# Altium project _K1986VK025 MiniBoard.PrjPCB
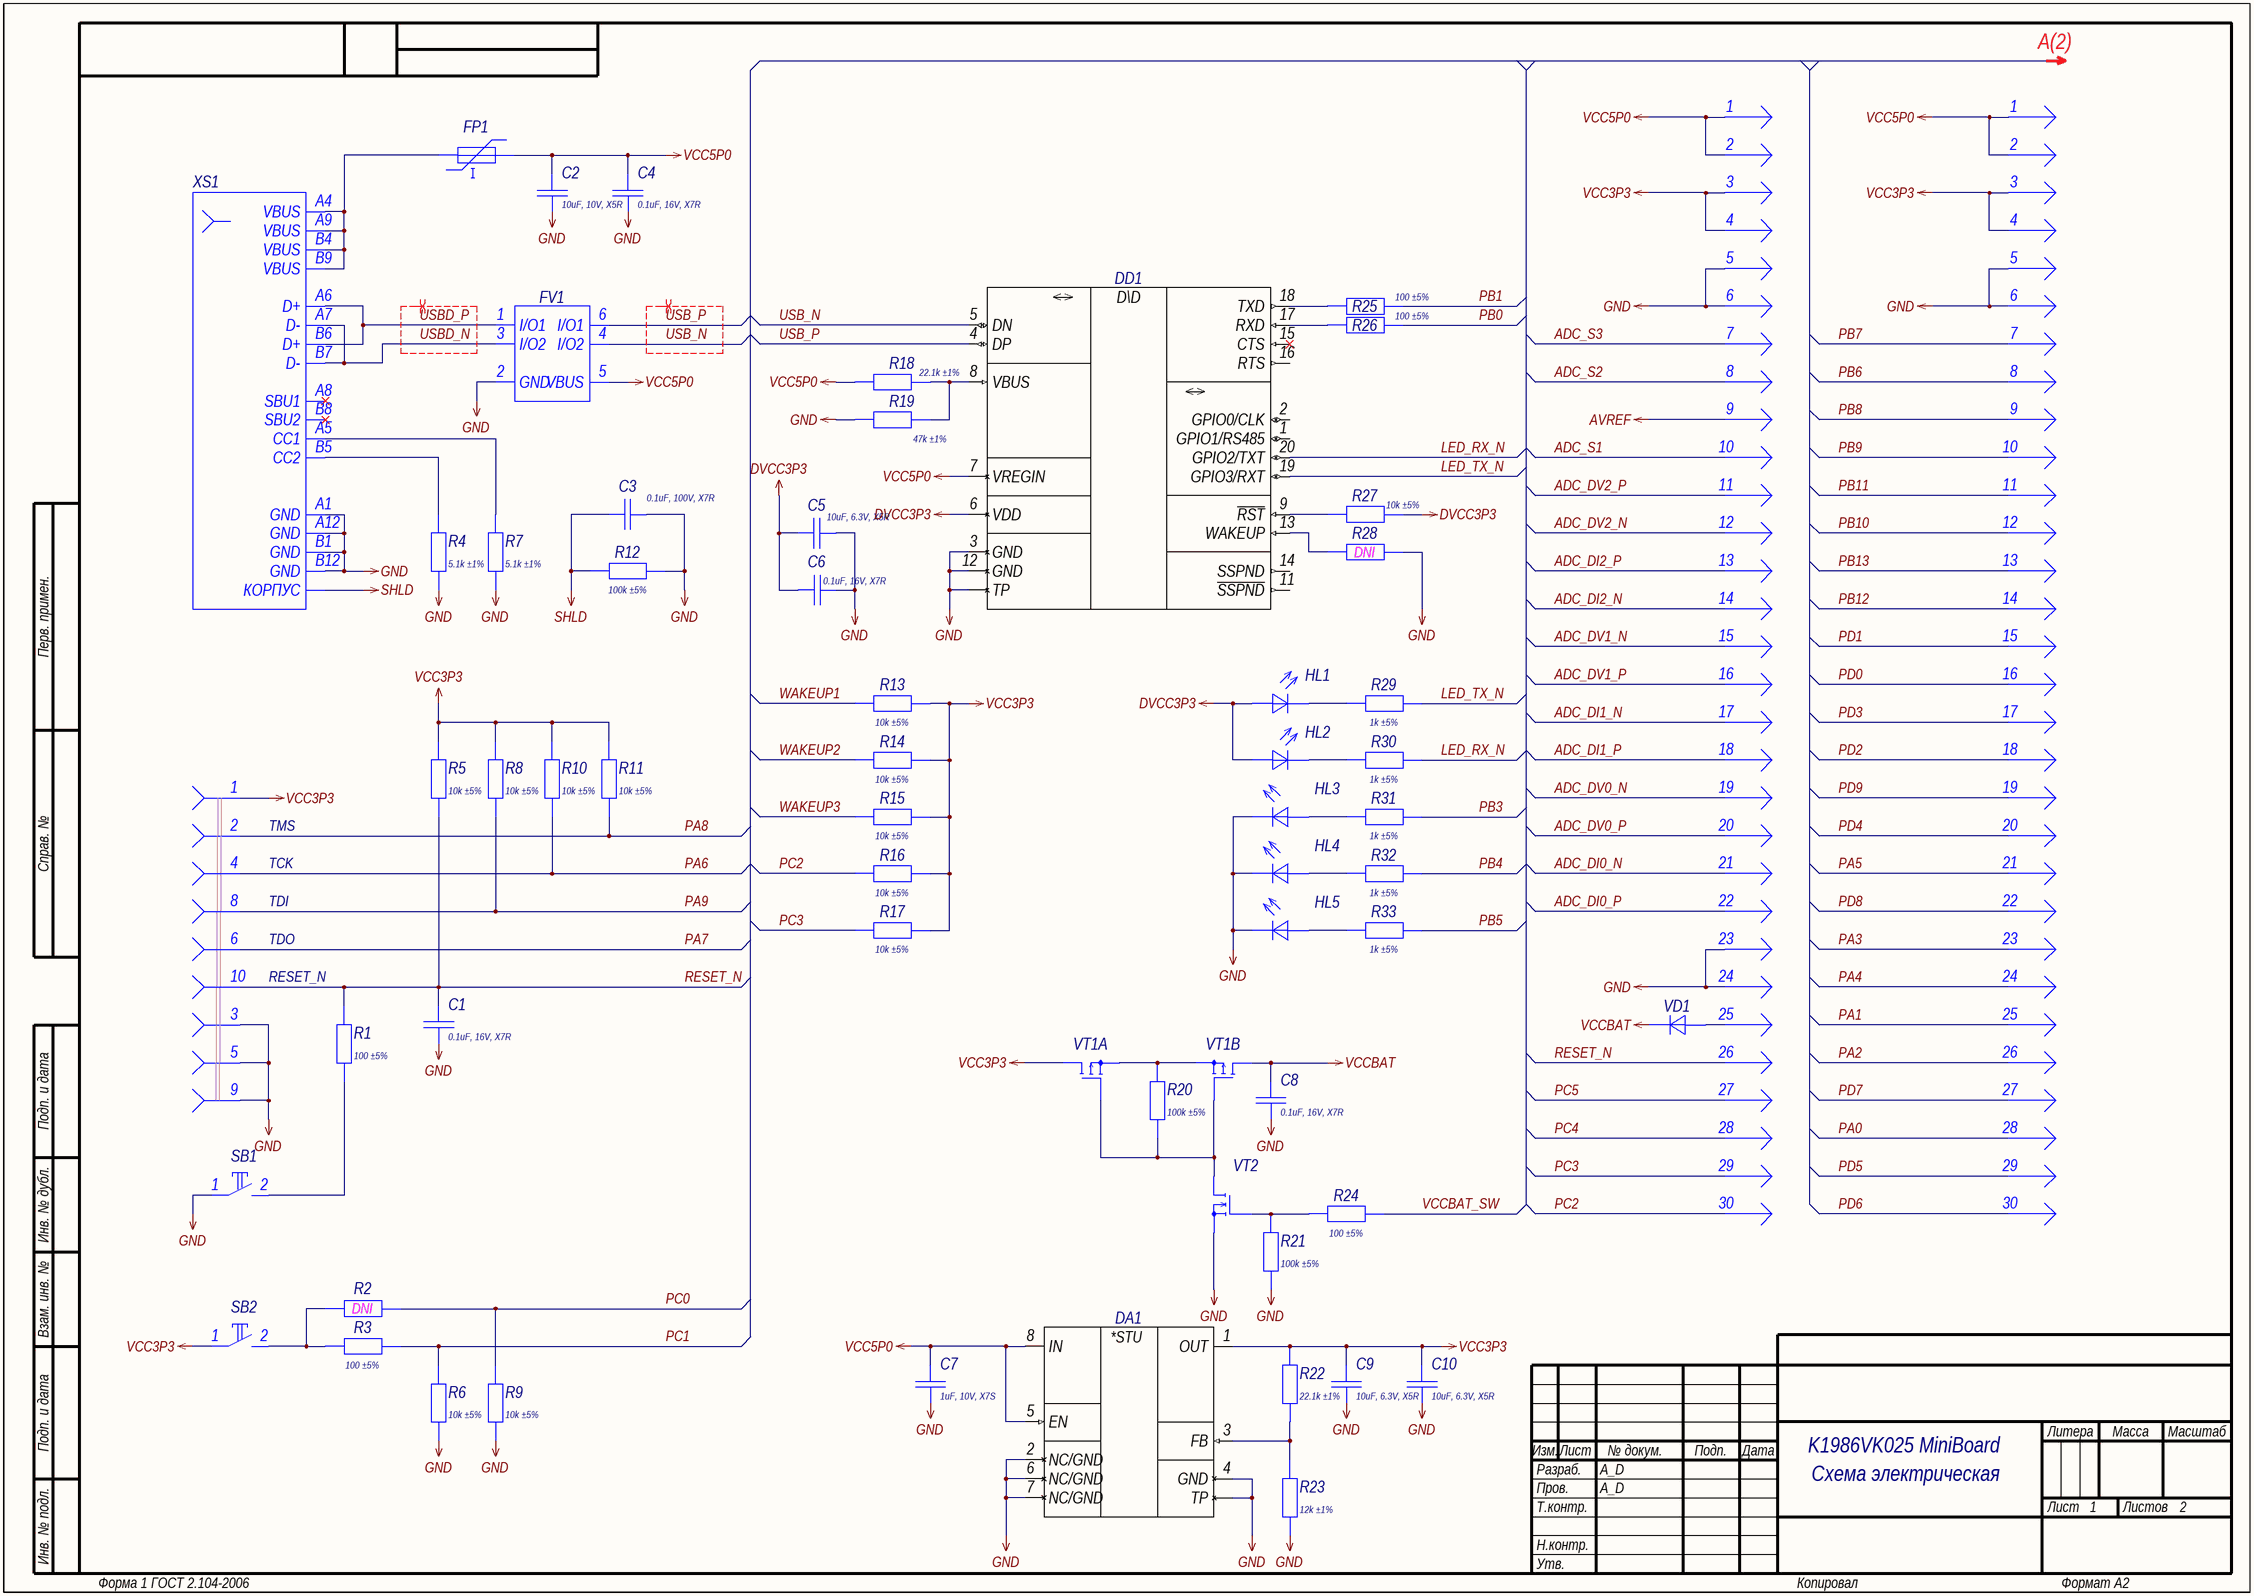
[diagram p0: 01_USB_IO.SchDoc]
GlobalOrganizationName: A_D Electronics; GlobalProjectName: K1986VK025 MiniBoard; GlobalProjectNumber: A_D.000000.001; GlobalProjectRevision: 0; PCB_Week: 2109
2 sheets, 91 parts. Net scope: global (net labels, ports and power ports of the same name join across sheets).
Board file: BOARD.PcbDoc
Sheets:
  01_USB_IO.SchDoc
  02_MCU_ANALOG.SchDoc

## Sheet 01_USB_IO.SchDoc: =GlobalProjectName
size 594 x 420 mm; CheckedBy: A_D; Author: A_D; Organization: A_D Electronics; DocumentNumber: A_D.000000.001 Э3; Revision: 0; SheetNumber: 1; SheetTotal: 2; PageSetup: Record=PageOptions|CenterHorizontal=True|CenterVertical=True|PrintScale=0.70|XCorrection=1.00|YCorrection=1.00|PrintKind=2|BorderSize=5000000|LeftOffset=9000|BottomOffset=10100|Orientation=2|PaperLength=11176|PaperWidth=8636|Scale=100|PaperSource=259|PrintQuality=-3|MediaType=1|DitherType=10|PrintScaleMode=1|PaperKind=A3|PaperIndex=8; FirstApplication: A_D.000000.001; DocumentName: K1986VK025 MiniBoard

### Parts
C1  Schematic Value: 0.1uF, 16V, X7R  [C0402_100X050H050_H]  (hidden comment: Capacitor)
C2  Schematic Value: 10uF, 10V, X5R  [C0603_160X080H080_H]  (hidden comment: Capacitor)
C3  Schematic Value: 0.1uF, 100V, X7R  [C0603_160X080H080_H]  (hidden comment: Capacitor)
C4  Schematic Value: 0.1uF, 16V, X7R  [C0402_100X050H050_H]  (hidden comment: Capacitor)
C5  Schematic Value: 10uF, 6.3V, X5R  [C0402_100X050H050_H]  (hidden comment: Capacitor)
C6  Schematic Value: 0.1uF, 16V, X7R  [C0402_100X050H050_H]  (hidden comment: Capacitor)
C7  Schematic Value: 1uF, 10V, X7S  [C0402_100X050H050_H]  (hidden comment: Capacitor)
C8  Schematic Value: 0.1uF, 16V, X7R  [C0402_100X050H050_H]  (hidden comment: Capacitor)
C9  Schematic Value: 10uF, 6.3V, X5R  [C0402_100X050H050_H]  (hidden comment: Capacitor)
C10  Schematic Value: 10uF, 6.3V, X5R  [C0402_100X050H050_H]  (hidden comment: Capacitor)
DA1  TPS73501DRB  [VSON-8_065P300X300X100_N]  (value not drawn)
DD1  CP2102N-xxx-GQFN20  [QFN-20_050P300X300X080_N]  (value not drawn)
FP1  Fuse_PTC  [F0603_160X080H075_H]  (value not drawn)
FV1  USBLC6-2x6  [SOT-666_050P160X120X060_N]  (value not drawn)
HL1  TX  [LD0402]  (value not drawn)
HL2  RX  [LD0402]  (value not drawn)
HL3  PB3  [LD0402]  (value not drawn)
HL4  PB4  [LD0402]  (value not drawn)
HL5  PB5  [LD0402]  (value not drawn)
R1  Schematic Value: 100 ±5%  [R0402_100X050H035_H]  (hidden comment: Resistor)
R2  Resistor  [R0402_100X050H035_H]  (value not drawn)  (no BOM)
R3  Schematic Value: 100 ±5%  [R0402_100X050H035_H]  (hidden comment: Resistor)
R4  Schematic Value: 5.1k ±1%  [R0402_100X050H035_H]  (hidden comment: Resistor)
R5  Schematic Value: 10k ±5%  [R0402_100X050H035_H]  (hidden comment: Resistor)
R6  Schematic Value: 10k ±5%  [R0402_100X050H035_H]  (hidden comment: Resistor)
R7  Schematic Value: 5.1k ±1%  [R0402_100X050H035_H]  (hidden comment: Resistor)
R8  Schematic Value: 10k ±5%  [R0402_100X050H035_H]  (hidden comment: Resistor)
R9  Schematic Value: 10k ±5%  [R0402_100X050H035_H]  (hidden comment: Resistor)
R10  Schematic Value: 10k ±5%  [R0402_100X050H035_H]  (hidden comment: Resistor)
R11  Schematic Value: 10k ±5%  [R0402_100X050H035_H]  (hidden comment: Resistor)
R12  Schematic Value: 100k ±5%  [R0402_100X050H035_H]  (hidden comment: Resistor)
R13  Schematic Value: 10k ±5%  [R0402_100X050H035_H]  (hidden comment: Resistor)
R14  Schematic Value: 10k ±5%  [R0402_100X050H035_H]  (hidden comment: Resistor)
R15  Schematic Value: 10k ±5%  [R0402_100X050H035_H]  (hidden comment: Resistor)
R16  Schematic Value: 10k ±5%  [R0402_100X050H035_H]  (hidden comment: Resistor)
R17  Schematic Value: 10k ±5%  [R0402_100X050H035_H]  (hidden comment: Resistor)
R18  Schematic Value: 22.1k ±1%  [R0402_100X050H035_H]  (hidden comment: Resistor)
R19  Schematic Value: 47k ±1%  [R0402_100X050H035_H]  (hidden comment: Resistor)
R20  Schematic Value: 100k ±5%  [R0402_100X050H035_H]  (hidden comment: Resistor)
R21  Schematic Value: 100k ±5%  [R0402_100X050H035_H]  (hidden comment: Resistor)
R22  Schematic Value: 22.1k ±1%  [R0402_100X050H035_H]  (hidden comment: Resistor)
R23  Schematic Value: 12k ±1%  [R0402_100X050H035_H]  (hidden comment: Resistor)
R24  Schematic Value: 100 ±5%  [R0402_100X050H035_H]  (hidden comment: Resistor)
R25  Schematic Value: 100 ±5%  [R0402_100X050H035_H]  (hidden comment: Resistor)
R26  Schematic Value: 100 ±5%  [R0402_100X050H035_H]  (hidden comment: Resistor)
R27  Schematic Value: 10k ±5%  [R0402_100X050H035_H]  (hidden comment: Resistor)
R28  Resistor  [R0402_100X050H035_H]  (value not drawn)  (no BOM)
R29  Schematic Value: 1k ±5%  [R0402_100X050H035_H]  (hidden comment: Resistor)
R30  Schematic Value: 1k ±5%  [R0402_100X050H035_H]  (hidden comment: Resistor)
R31  Schematic Value: 1k ±5%  [R0402_100X050H035_H]  (hidden comment: Resistor)
R32  Schematic Value: 1k ±5%  [R0402_100X050H035_H]  (hidden comment: Resistor)
R33  Schematic Value: 1k ±5%  [R0402_100X050H035_H]  (hidden comment: Resistor)
SB1  Reset  [IT-1185AP]  (value not drawn)
SB2  Mode  [IT-1185AP]  (value not drawn)
VD1  Diode  [SOD-523]  (value not drawn)
VT1  MOSFET-PP_8p_2  [SOT-1118-2M_065P200X200X065_N]  (value not drawn)  (parts A,B of 2)
VT2  MOSFET-N_32  [SOT-883B_035P060X100X040_N]  (value not drawn)
XP1  Text  [PLD-30]  (value not drawn)  (parts A,B,C,D,E,F,G,H,I,J,K,L,M,N,O,P,Q,R,S,T,U,V,W,X,Y,Z,27,28,29,30 of 30)
XP2  Text  [PLD-30]  (value not drawn)  (parts A,B,C,D,E,F,G,H,I,J,K,L,M,N,O,P,Q,R,S,T,U,V,W,X,Y,Z,27,28,29,30 of 30)
XS1  Text  [U262-161N-4BVC11]  (value not drawn)
XS2  JTAG-FFC  [XF2M-1015-1A]  (value not drawn)  (parts A,B,C,D,E,F,H,I,J of 10)

### Nets
AVREF: XP1.9
DVCC3P3: C5.2 C6.1 DD1.6(VDD) HL1.1(А) HL2.1(А) R27.1
GND: C1.2 C2.1 C3.1 C4.1 C5.1 C6.2 C7.1 C8.2 C9.1 C10.1 DA1.2(NC/GND) DA1.4(GND) DA1.6(NC/GND) DA1.7(NC/GND) DA1.TP DD1.3(GND) DD1.12(GND) DD1.TP FV1.2(GND) HL3.2(К) HL4.2(К) HL5.2(К) R4.1 R6.1 R7.1 R9.1 R12.1 R19.2 R21.1 R23.1 R28.1 SB1.1 VT2.2(S) XP1.5 XP1.6 XP1.23 XP1.24 XP2.5 XP2.6 XS1.A1(GND) XS1.A12(GND) XS1.B1(GND) XS1.B12(GND) XS2.3 XS2.5 XS2.9
SHLD: C3.2 R12.2 XS1.SH(КОРПУС)
VCC3P3: C9.2 C10.2 DA1.1(OUT) R5.2 R8.2 R10.2 R11.2 R13.1 R14.1 R15.1 R16.1 R17.1 R22.2 SB2.1 VT1.6(D1) XP1.3 XP1.4 XP2.3 XP2.4 XS2.1
VCC5P0: C2.2 C4.2 C7.2 DA1.5(EN) DA1.8(IN) DD1.7(VREGIN) FP1.2 FV1.5(VBUS) R18.2 XP1.1 XP1.2 XP2.1 XP2.2
VCCBAT: C8.1 VD1.2(К) VT1.3(D2)
ADC_DI0_N: XP1.21
ADC_DI0_P: XP1.22
ADC_DI1_N: XP1.17
ADC_DI1_P: XP1.18
ADC_DI2_N: XP1.14
ADC_DI2_P: XP1.13
ADC_DV0_N: XP1.19
ADC_DV0_P: XP1.20
ADC_DV1_N: XP1.15
ADC_DV1_P: XP1.16
ADC_DV2_N: XP1.12
ADC_DV2_P: XP1.11
ADC_S1: XP1.10
ADC_S2: XP1.8
ADC_S3: XP1.7
LED_RX_N: DD1.20(GPIO2/TXT) R30.2
LED_TX_N: DD1.19(GPIO3/RXT) R29.2
PA0: XP2.28
PA1: XP2.25
PA2: XP2.26
PA3: XP2.23
PA4: XP2.24
PA5: XP2.21
PA6: R10.1 XS2.4
PA7: XS2.6
PA8: R11.1 XS2.2
PA9: R8.1 XS2.8
PB0: R26.1
PB1: R25.1
PB3: R31.2
PB4: R32.2
PB5: R33.2
PB6: XP2.8
PB7: XP2.7
PB8: XP2.9
PB9: XP2.10
PB10: XP2.12
PB11: XP2.11
PB12: XP2.14
PB13: XP2.13
PC0: R2.1 R9.2
PC1: R3.1 R6.2
PC2: R16.2 XP1.30
PC3: R17.2 XP1.29
PC4: XP1.28
PC5: XP1.27
PD0: XP2.16
PD1: XP2.15
PD2: XP2.18
PD3: XP2.17
PD4: XP2.20
PD5: XP2.29
PD6: XP2.30
PD7: XP2.27
PD8: XP2.22
PD9: XP2.19
RESET_N: C1.1 R1.2 R5.1 XP1.26 XS2.10
USB_N: DD1.5(DN) FV1.4(I/O2)
USB_P: DD1.4(DP) FV1.6(I/O1)
USBD_N: FV1.3(I/O2) XS1.A7(D-) XS1.B7(D-)
USBD_P: FV1.1(I/O1) XS1.A6(D+) XS1.B6(D+)
VCCBAT_SW: R24.1
WAKEUP1: R13.2
WAKEUP2: R14.2
WAKEUP3: R15.2
NetDA1_3: DA1.3(FB) R22.1 R23.2
NetDD1_8: DD1.8(VBUS) R18.1 R19.1
NetDD1_9: DD1.9(~{RST}) R27.2
NetDD1_13: DD1.13(WAKEUP) R28.2
NetDD1_17: DD1.17(RXD) R26.2
NetDD1_18: DD1.18(TXD) R25.2
NetFP1_1: FP1.1 XS1.A4(VBUS) XS1.A9(VBUS) XS1.B4(VBUS) XS1.B9(VBUS)
NetHL1_2: HL1.2(К) R29.1
NetHL2_2: HL2.2(К) R30.1
NetHL3_1: HL3.1(А) R31.1
NetHL4_1: HL4.1(А) R32.1
NetHL5_1: HL5.1(А) R33.1
NetR1_1: R1.1 SB1.2
NetR2_2: R2.2 R3.2 SB2.2
NetR4_2: R4.2 XS1.B5(CC2)
NetR7_2: R7.2 XS1.A5(CC1)
NetR20_1: R20.1 VT1.2(G1) VT1.5(G2) VT2.3(D)
NetR20_2: R20.2 VT1.1(S1) VT1.4(S2)
NetR21_2: R21.2 R24.2 VT2.1(G)
NetVD1_1: VD1.1(А) XP1.25

Not connected (* = marked no-connect by the designer): DD1 1(GPIO1/RS485) 2(GPIO0/CLK) 11(~{SSPND}) 14(SSPND) 15(CTS)* 16(RTS); XS1 A8(SBU1)* B8(SBU2)*

### Layout directives
differential pair; differential pair class USBD: USBD_N, USBD_P
differential pair; differential pair class USB: USB_N, USB_P

### Notes on the sheet
- А(2)
- (near R28) DNI
- TMS
- TCK
- TDI
- RESET_N
- TDO
- (near R2) DNI
- Схема электрическая
  принципиальная
- Перв. примен.
- Справ. №
- Подп. и дата
- Инв. № дубл.
- Взам. инв. №
- Разраб.
- Изм.
- Лист
- № докум.
- Подп.
- Дата
- Литера
- Масса
- Масштаб
- Пров.
- Т.контр.
- Листов
- Инв. № подл.
- Н.контр.
- Утв.
- Форма 1 ГОСТ 2.104-2006
- Копировал
- Формат А2
- (in symbol CP2102N-A01-GQFN20) D\D
- (in symbol TPS73501DRBR) *STU

### Library data of the parts
C1 C4 C6 C8 = GCM155R71C104KA55D: Manufacturer: Murata; Type: Конденсатор; ID: 163; Value: 0.1uF; Voltage: 16V; Tolerance: ±10%; Dielectric Type: X7R; Application Category: 1; Working Temperature Min: -55°С; Working Temperature Max: +125°С; Functional Analog: GRM155R71C104KA88D, GCM155R71C104KA55J, GCM155R71C104KA55W; Published: 18.05.2010; Publisher: Andrew Danich; Part Number: GCM155R71C104KA55D; Footprint: 0402
  C4 C6 C8: ClassName: DirectConnect
C2 = GRM188R61A106KE69D: Manufacturer: Murata; Type: Конденсатор; ID: 173; Value: 10uF; Voltage: 10V; Tolerance: ±10%; Dielectric Type: X5R; Application Category: 1; Working Temperature Min: -55°С; Working Temperature Max: +85°С; Functional Analog: GRM188R61A106KE69J; Published: 18.05.2010; Publisher: Andrew Danich; Part Number: GRM188R61A106KE69D; Footprint: 0603; ClassName: DirectConnect
C3 = GRM188R72A104KA35D: Manufacturer: Murata; Type: Конденсатор; ID: 232; Value: 0.1uF; Voltage: 100V; Tolerance: ±10%; Dielectric Type: X7R; Application Category: 1; Working Temperature Min: -55°С; Working Temperature Max: +125°С; Functional Analog: GRM188R72A104KA35J; Published: 18.05.2010; Publisher: Andrew Danich; Part Number: GRM188R72A104KA35D; Footprint: 0603
C5 C9 C10 = GRM155R60J106ME15D: Manufacturer: Murata; Type: Конденсатор; ID: 234; Value: 10uF; Voltage: 6.3V; Tolerance: ±20%; Dielectric Type: X5R; Application Category: 1; Working Temperature Min: -55°С; Working Temperature Max: +85°С; Functional Analog: GRM155R60J106ME15J; Published: 18.05.2010; Publisher: Andrew Danich; Part Number: GRM155R60J106ME15D; Footprint: 0402; ClassName: DirectConnect
C7 = GRM155C71A105KE11D: Manufacturer: Murata; Type: Конденсатор; ID: 179; Value: 1uF; Voltage: 10V; Tolerance: ±10%; Dielectric Type: X7S; Application Category: 1; Working Temperature Min: -55°С; Working Temperature Max: +125°С; Functional Analog: GRM155C71A105KE11J; Published: 18.05.2010; Publisher: Andrew Danich; Part Number: GRM155C71A105KE11D; Footprint: 0402; ClassName: DirectConnect
DA1 = TPS73501DRBR: Manufacturer: Texas Instruments; ID: 27; Input Voltage: +2.2…5.5V; Output Current: 500mA; Output Voltage: +1.2…5.5V; RMS Noise: 13.2uV; Application Category: 1; Working Temperature Min: -40°С; Working Temperature Max: +125°С; Functional Analog: TPS73501DRBT; Published: 25.03.2019; Publisher: Andrew Danich; Type: Микросхема; Part Number: TPS73501DRBR; Value: TPS73501DRBR; ClassName: DirectConnect
DD1 = CP2102N-A01-GQFN20: Manufacturer: Silicon Labs; ID: 14; Supply Operation: +3.0…3.6V; Supply Current: 13.7mA; USB Type Support: USB 2.0; USB Speed Support: 12 Mb/s; OTG Support: No; Input Interface: UART; Channels: 1; Working Temperature Min: -40°C; Working Temperature Max: +85°C; Functional Analog: CP2102N-A02-GQFN20; Published: 16.07.2019; Publisher: Andrew Danich; Type: Микросхема; Part Number: CP2102N-A01-GQFN20; Value: CP2102N-A01-GQFN20; Application Category: 1; ClassName: DirectConnect
FP1 = 0603L100SLYR: Manufacturer: Littelfuse; ID: 13; Limit Voltage: 6V; Hold Current: 1A; Resistance: 0.12ohm; Trip Current: 1.8A; Current Rating Max: 50A; Application Category: 1; Working Temperature Min: -40°С; Working Temperature Max: +85°С; Published: 25.0.2017; Type: Предохранитель самовосстанавливающийся; Part Number: 0603L100SLYR; Value: 0603L100SLYR; ClassName: DirectConnect
FV1 = USBLC6-2P6: Manufacturer: STMicroelectronics; ID: 30; Breakdown Voltage: 6V; Reverse Stand Off Voltage: 17V; Forward Voltage: 0.95V; Peak Forward Current: 5A; Junction Capacitance: 2.5pF; Directional: Bidirectional; Application Category: 1; Working Temperature Min: -40°С; Working Temperature Max: +125°С; Published: 21.02.2017; Publisher: Andrew Danich; Type: Супрессор; Part Number: USBLC6-2P6; Value: USBLC6-2P6; Functional Analog: -; ClassName: DirectConnect
HL1 = KPHHS-1005SURCK: Manufacturer: Kingbright; Type: Индикатор единичный; ID: 35; Forward Voltage: 2.5V; Forward Current: 20mA; Power Dissipation: 75mW; Luminous Flux: 140; Color: Red; Leds: 1; Working Temperature Min: -40°С; Working Temperature Max: +85°С; Published: 03.12.2013; Publisher: Andrew Danich; Part Number: KPHHS-1005SURCK; Value: KPHHS-1005SURCK; Footprint: 0402; Application Category: 1
HL2 = KPHHS-1005CGCK: Manufacturer: Kingbright; Type: Индикатор единичный; ID: 25; Forward Voltage: 2.1V; Forward Current: 20mA; Power Dissipation: 75mW; Luminous Flux: 60; Color: Green; Leds: 1; Working Temperature Min: -40°С; Working Temperature Max: +85°С; Published: 03.12.2013; Publisher: Andrew Danich; Part Number: KPHHS-1005CGCK; Value: KPHHS-1005CGCK; Footprint: 0402; Application Category: 1
HL3-HL5 = KPHHS-1005QBC-D-V: Manufacturer: Kingbright; Type: Индикатор единичный; ID: 24; Forward Voltage: 3.3V; Forward Current: 20mA; Power Dissipation: 120mW; Luminous Flux: 60; Color: Blue; Leds: 1; Working Temperature Min: -40°С; Working Temperature Max: +85°С; Published: 03.12.2013; Publisher: Andrew Danich; Part Number: KPHHS-1005QBC-D-V; Value: KPHHS-1005QBC-D-V; Footprint: 0402; Application Category: 1
R1 R3 R24-R26 = RC0402JR-07100RL: Manufacturer: Yageo; ID: 479; Value: 100; Limit Voltage: 50V; Tolerance: ±5%; Temperature Coefficient: 100ppm; Total Power Dissipation: 0.1W; Series Type: Thick-Film; Application Category: 1; Working Temperature Min: -55°С; Working Temperature Max: +155°С; Published: 24.03.2010; Publisher: Andrew Danich; Type: Резистор; Part Number: RC0402JR-07100RL; Footprint: 0402
R2 = RC0402JR-070RL: Manufacturer: Yageo; ID: 362; Value: 0; Limit Voltage: 50V; Tolerance: ±5%; Temperature Coefficient: 100ppm; Total Power Dissipation: 0.1W; Series Type: Thick-Film; Application Category: 1; Working Temperature Min: -55°С; Working Temperature Max: +155°С; Schematic Value: 0 ±5%; Published: 24.03.2010; Publisher: Andrew Danich; Type: Резистор; Part Number: RC0402JR-070RL; Footprint: 0402
R4 R7 = RC0402FR-075K1L: Manufacturer: Yageo; ID: 496; Value: 5.1k; Limit Voltage: 50V; Tolerance: ±1%; Temperature Coefficient: 100ppm; Total Power Dissipation: 0.1W; Series Type: Thick-Film; Application Category: 1; Working Temperature Min: -55°С; Working Temperature Max: +155°С; Published: 24.03.2010; Publisher: Andrew Danich; Type: Резистор; Part Number: RC0402FR-075K1L; Footprint: 0402
R5 R6 R8-R11 R13-R17 R27 = RC0402JR-0710KL: Manufacturer: Yageo; ID: 476; Value: 10k; Limit Voltage: 50V; Tolerance: ±5%; Temperature Coefficient: 100ppm; Total Power Dissipation: 0.1W; Series Type: Thick-Film; Application Category: 1; Working Temperature Min: -55°С; Working Temperature Max: +155°С; Published: 24.03.2010; Publisher: Andrew Danich; Type: Резистор; Part Number: RC0402JR-0710KL; Footprint: 0402
R12 R20 R21 = RC0402JR-07100KL: Manufacturer: Yageo; ID: 351; Value: 100k; Limit Voltage: 50V; Tolerance: ±5%; Temperature Coefficient: 100ppm; Total Power Dissipation: 0.1W; Series Type: Thick-Film; Application Category: 1; Working Temperature Min: -55°С; Working Temperature Max: +155°С; Published: 24.03.2010; Publisher: Andrew Danich; Type: Резистор; Part Number: RC0402JR-07100KL; Footprint: 0402
R18 R22 = RC0402FR-0722K1L: Manufacturer: Yageo; ID: 447; Value: 22.1k; Limit Voltage: 50V; Tolerance: ±1%; Temperature Coefficient: 100ppm; Total Power Dissipation: 0.1W; Series Type: Thick-Film; Application Category: 1; Working Temperature Min: -55°С; Working Temperature Max: +155°С; Published: 24.03.2010; Publisher: Andrew Danich; Type: Резистор; Part Number: RC0402FR-0722K1L; Footprint: 0402
R19 = RC0402FR-0747KL: Manufacturer: Yageo; ID: 528; Value: 47k; Limit Voltage: 50V; Tolerance: ±1%; Temperature Coefficient: 100ppm; Total Power Dissipation: 0.1W; Series Type: Thick-Film; Application Category: 1; Working Temperature Min: -55°С; Working Temperature Max: +155°С; Published: 24.03.2010; Publisher: Andrew Danich; Type: Резистор; Part Number: RC0402FR-0747KL; Footprint: 0402
R23 = RC0402FR-0712KL: Manufacturer: Yageo; ID: 318; Value: 12k; Limit Voltage: 50V; Tolerance: ±1%; Temperature Coefficient: 100ppm; Total Power Dissipation: 0.1W; Series Type: Thick-Film; Application Category: 1; Working Temperature Min: -55°С; Working Temperature Max: +155°С; Published: 24.03.2010; Publisher: Andrew Danich; Type: Резистор; Part Number: RC0402FR-0712KL; Footprint: 0402
R28 = RC0402JR-0710KL: Manufacturer: Yageo; ID: 476; Value: 10k; Limit Voltage: 50V; Tolerance: ±5%; Temperature Coefficient: 100ppm; Total Power Dissipation: 0.1W; Series Type: Thick-Film; Application Category: 1; Working Temperature Min: -55°С; Working Temperature Max: +155°С; Schematic Value: 10k ±5%; Published: 24.03.2010; Publisher: Andrew Danich; Type: Резистор; Part Number: RC0402JR-0710KL; Footprint: 0402
R29-R33 = RC0402JR-071KL: Manufacturer: Yageo; ID: 3; Value: 1k; Limit Voltage: 50V; Tolerance: ±5%; Temperature Coefficient: 100ppm; Total Power Dissipation: 0.1W; Series Type: Thick-Film; Application Category: 1; Working Temperature Min: -55°С; Working Temperature Max: +155°С; Published: 24.03.2010; Publisher: Andrew Danich; Type: Резистор; Part Number: RC0402JR-071KL; Footprint: 0402
SB1 SB2 = IT-1185AP: ID: 36; Limit Current: 50mA; Resistance: 0.1ohm; Isolator Resistance: 100meg; Backlight: NO; Number of Contacts: 2; Application Category: 1; Published: 17.04.2014; Publisher: Andrew Danich; Type: Переключатель; Part Number: IT-1185AP; Value: IT-1185AP; Height: 5mm
VD1 = 1N4148WT-7: Manufacturer: Diodes Incorporated; Type: Диод; ID: 18; Reverse Voltage: 100V; Reverse Current: 1uA; Forward Voltage: 1.25V; Forward Current: 250mA; Total Power Dissipation: 200mW; Capacitance: 2pF; Recovery Time: 4nS; Application Category: 1; Working Temperature Min: -65°С; Working Temperature Max: +150°С; Functional Analog: 1N4148X-TP; Published: 18.05.2010; Publisher: Andrew Danich; Part Number: 1N4148WT-7; Value: 1N4148WT-7
VT1 = PMDPB70XP: Manufacturer: NXP Semiconductors; Type: Сборка транзисторная; ID: 43; D-S Voltage: -30V; Drain Current: -3.8A; D-S On-Resistance: 87momh; Gate Capacitance: 680pF; Total Power Dissipation: 490mW; Gate Threshold Voltage: -1V; Application Category: 1; Working Temperature Min: -55°С; Working Temperature Max: +150°С; Published: 18.07.2014; Publisher: Andrew Danich; Part Number: PMDPB70XP; Value: PMDPB70XP; ClassName: DirectConnect
VT2 = NX3008NBKMB: Manufacturer: NXP Semiconductors; Type: Транзистор; ID: 36; D-S Voltage: 30V; Drain Current: 530mA; D-S On-Resistance: 1.4omh; Gate Capacitance: 50pF; Total Power Dissipation: 360mW; Gate Threshold Voltage: 1.1V; Application Category: 1; Working Temperature Min: -55°С; Working Temperature Max: +150°С; Published: 24.09.2010; Publisher: Andrew Danich; Part Number: NX3008NBKMB; Value: NX3008NBKMB
XP1 XP2 = PLD-30: ID: 65; Value: PLD-30; Limit Voltage: 250V; Limit Current: 3A; Connector Type: Male; Resistance: 15momh; Surface Finish: Gold; Pitch: 2.54mm; Application Category: 1; Published: 17.03.2018; Publisher: Andrew Danich; Type: Вилка; Part Number: PLD-30; Pins: 30
XS1 = U262-161N-4BVC11: Manufacturer: XKB Enterprise; ID: 41; Limit Voltage: 30V; Limit Current: 3A; Connector Type: Female; Interface: USB 3.1 Type C; Max Data Rate: 480 mbps; Application Category: 1; Working Temperature Min: -40°С; Working Temperature Max: +85°С; Functional Analog: C167321; Published: 17.09.2018; Publisher: Andrew Danich; Type: Розетка; Part Number: U262-161N-4BVC11; Value: U262-161N-4BVC11; Pins: 16; Mount Type: Surface; ClassName: DirectConnect
XS2 = XF2M-1015-1A: Manufacturer: Omron Electronics; ID: 7; Limit Voltage: 50V; Limit Current: 500mA; Connector Type: Female; Resistance: 0.05ohm; Pitch: 0.5mm; Application Category: 1; Working Temperature Min: -30°С; Working Temperature Max: +85°С; Published: 07.09.2015; Publisher: Viktor Klishin; Type: Розетка; Part Number: XF2M-1015-1A; Value: XF2M-1015-1A; Pins: 10; Series: FPC

## Sheet 02_MCU_ANALOG.SchDoc: =GlobalProjectName
size 594 x 420 mm; CheckedBy: A_D; Author: A_D; Organization: A_D Electronics; DocumentNumber: A_D.000000.001 Э3; Revision: 0; SheetNumber: 2; SheetTotal: 2; PageSetup: Record=PageOptions|CenterHorizontal=True|CenterVertical=True|PrintScale=0.70|XCorrection=1.00|YCorrection=1.00|PrintKind=2|BorderSize=5000000|LeftOffset=9000|BottomOffset=10100|Orientation=2|PaperLength=11176|PaperWidth=8636|Scale=100|PaperSource=259|PrintQuality=-3|MediaType=1|DitherType=10|PrintScaleMode=1|PaperKind=A3|PaperIndex=8; FirstApplication: A_D.000000.001; DocumentName: K1986VK025 MiniBoard
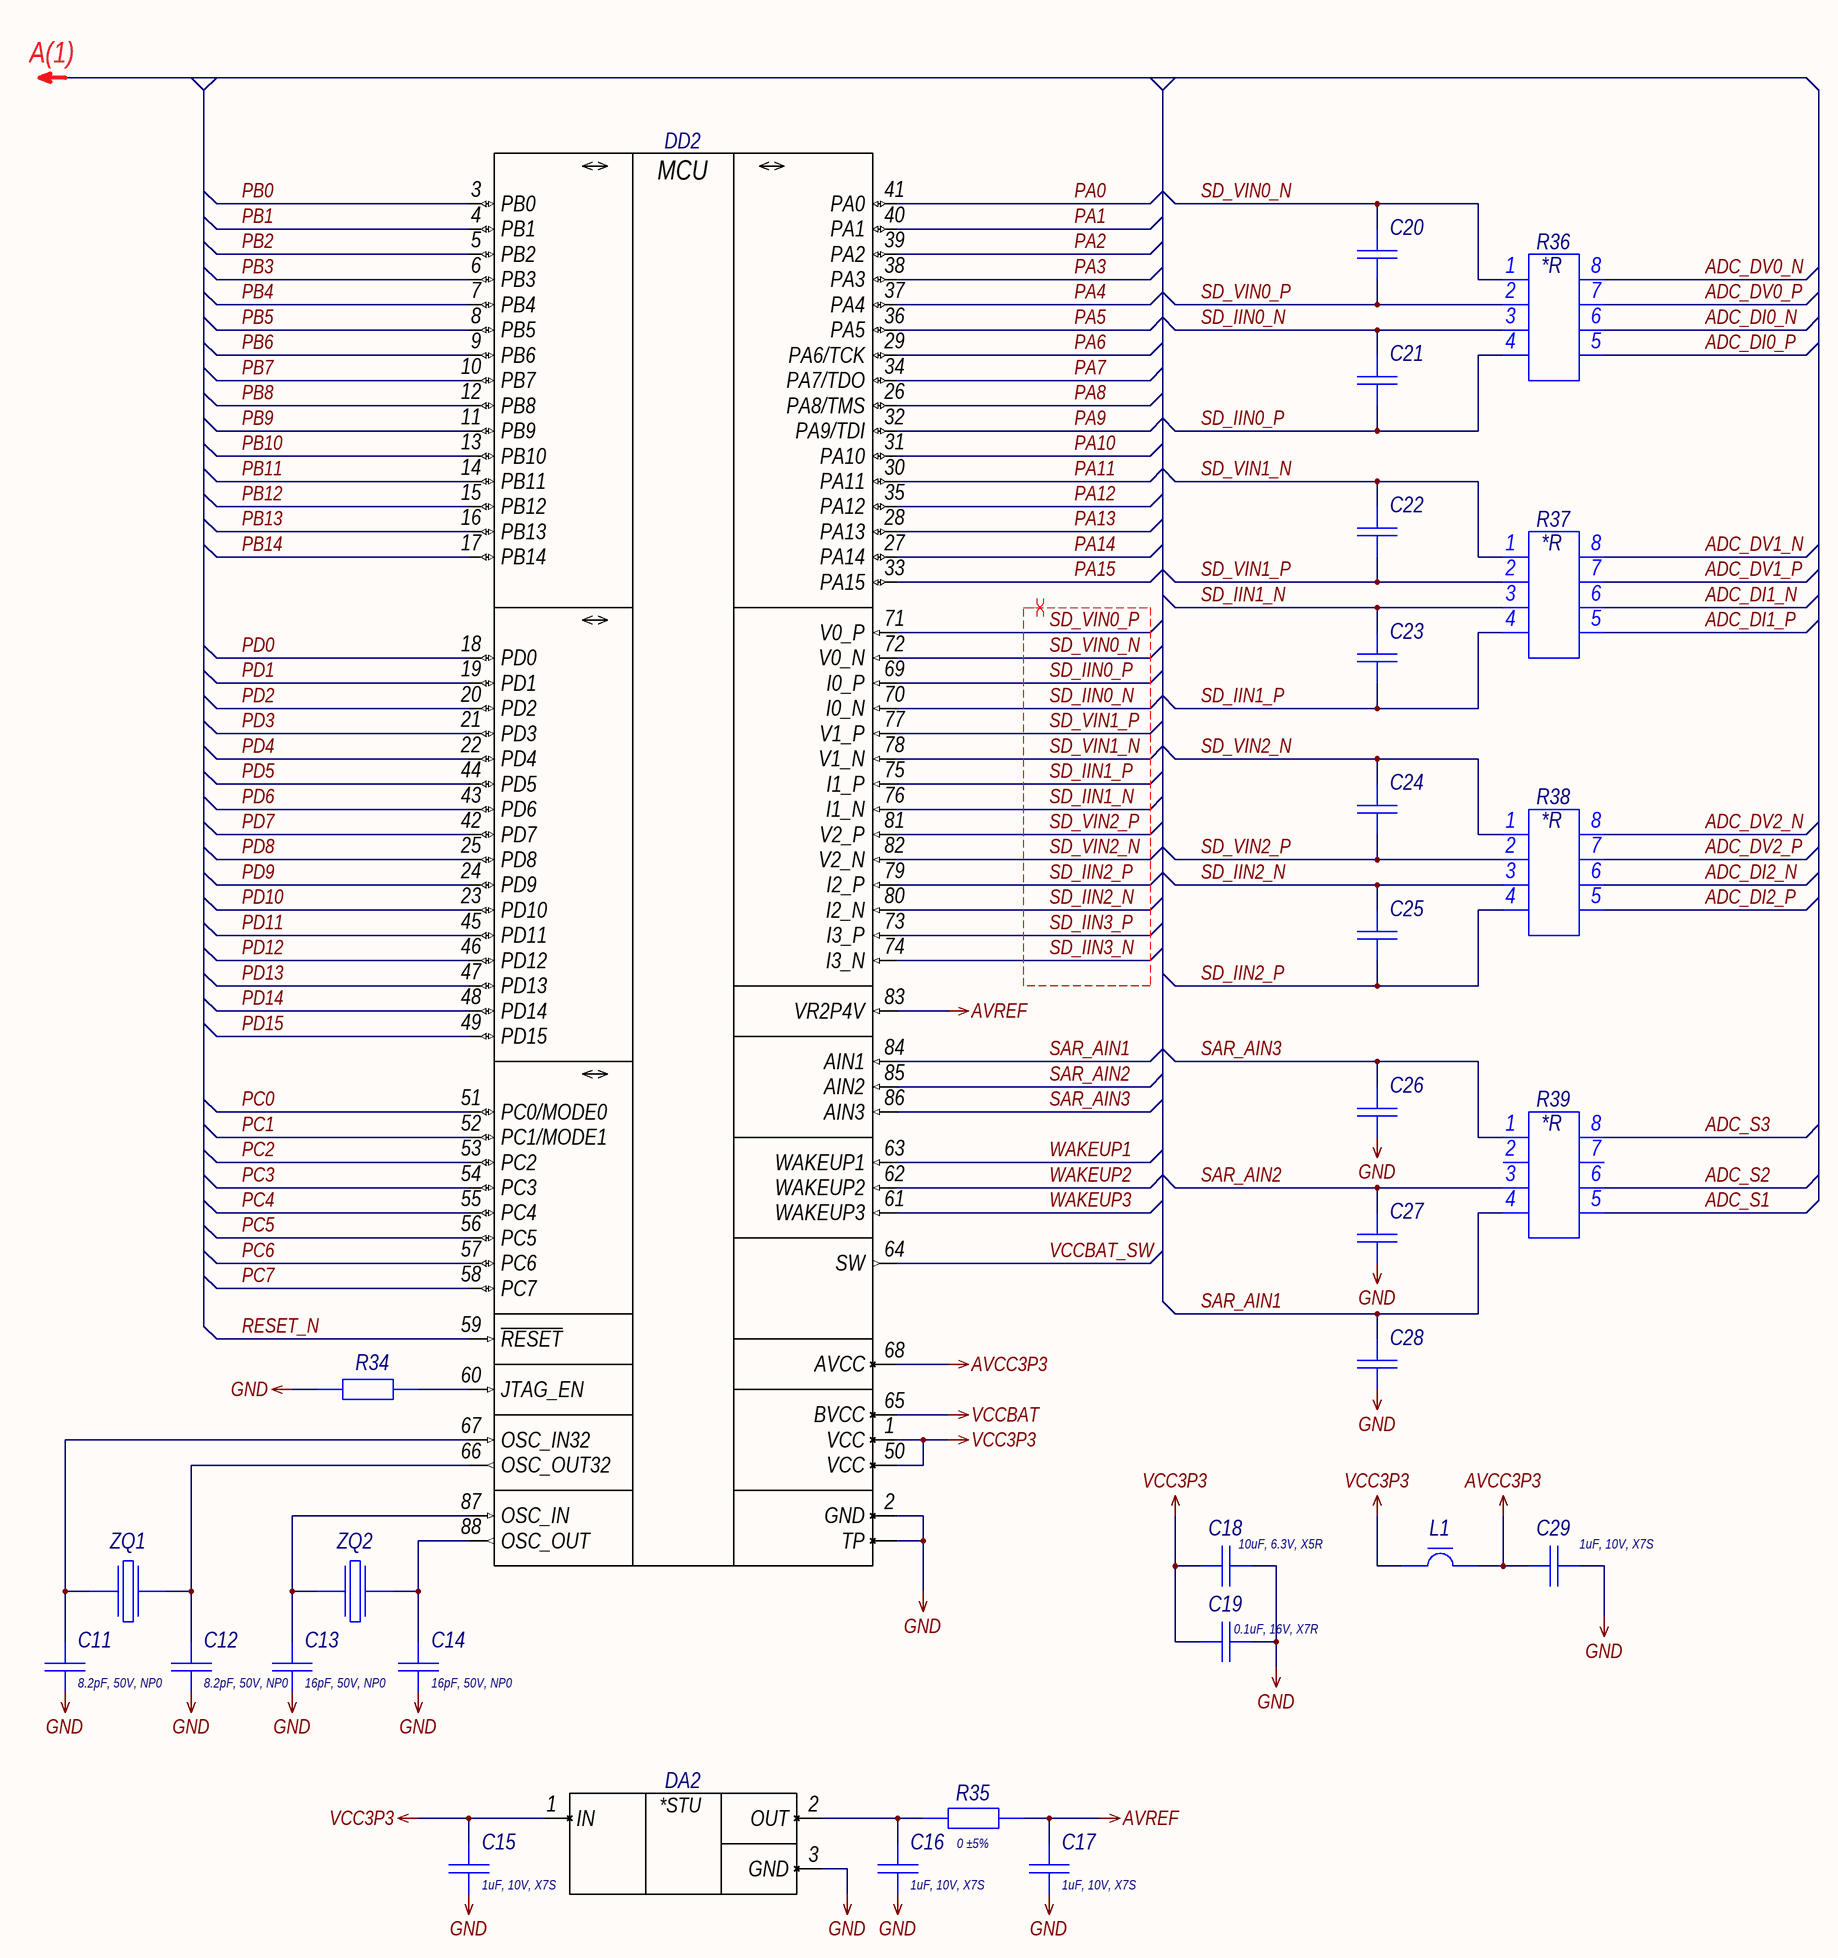
[diagram p1: 02_MCU_ANALOG.SchDoc]

### Parts
C11  Schematic Value: 8.2pF, 50V, NP0  [C0402_100X050H050_H]  (hidden comment: Capacitor)
C12  Schematic Value: 8.2pF, 50V, NP0  [C0402_100X050H050_H]  (hidden comment: Capacitor)
C13  Schematic Value: 16pF, 50V, NP0  [C0402_100X050H050_H]  (hidden comment: Capacitor)
C14  Schematic Value: 16pF, 50V, NP0  [C0402_100X050H050_H]  (hidden comment: Capacitor)
C15  Schematic Value: 1uF, 10V, X7S  [C0402_100X050H050_H]  (hidden comment: Capacitor)
C16  Schematic Value: 1uF, 10V, X7S  [C0402_100X050H050_H]  (hidden comment: Capacitor)
C17  Schematic Value: 1uF, 10V, X7S  [C0402_100X050H050_H]  (hidden comment: Capacitor)
C18  Schematic Value: 10uF, 6.3V, X5R  [C0402_100X050H050_H]  (hidden comment: Capacitor)
C19  Schematic Value: 0.1uF, 16V, X7R  [C0402_100X050H050_H]  (hidden comment: Capacitor)
C20  Capacitor  [C0201_060X030H030_H]  (value not drawn)
C21  Capacitor  [C0201_060X030H030_H]  (value not drawn)
C22  Capacitor  [C0201_060X030H030_H]  (value not drawn)
C23  Capacitor  [C0201_060X030H030_H]  (value not drawn)
C24  Capacitor  [C0201_060X030H030_H]  (value not drawn)
C25  Capacitor  [C0201_060X030H030_H]  (value not drawn)
C26  Capacitor  [C0201_060X030H030_H]  (value not drawn)
C27  Capacitor  [C0201_060X030H030_H]  (value not drawn)
C28  Capacitor  [C0201_060X030H030_H]  (value not drawn)
C29  Schematic Value: 1uF, 10V, X7S  [C0402_100X050H050_H]  (hidden comment: Capacitor)
DA2  REF33xxAIDBZx-Series  [SOT-23_190P290X160X145_N]  (value not drawn)
DD2  1986ВК025-Series  [QFN-88_040P1000X1000X080_N]  (value not drawn)
L1  FerriteBead  [L0402_100X050H050_H]  (value not drawn)
R34  Resistor  [R0402_100X050H035_H]  (value not drawn)
R35  Schematic Value: 0 ±5%  [R0402_100X050H035_H]  (hidden comment: Resistor)
R36  Resistor-4  [CAY10-x4]  (value not drawn)
R37  Resistor-4  [CAY10-x4]  (value not drawn)
R38  Resistor-4  [CAY10-x4]  (value not drawn)
R39  Resistor-4  [CAY10-x4]  (value not drawn)
ZQ1  Crystal  [SX-3215]  (value not drawn)
ZQ2  Crystal-1_3p  [SMD 3.2x2.5mm]  (value not drawn)

### Nets
AVCC3P3: C29.2 DD2.68(AVCC) L1.2
AVREF: C17.2 DD2.83(VR2P4V) R35.1
GND: C11.1 C12.1 C13.1 C14.1 C15.1 C16.1 C17.1 C18.1 C19.2 C26.1 C27.1 C28.1 C29.1 DA2.3(GND) DD2.2(GND) DD2.TP R34.2
VCC3P3: C15.2 C18.2 C19.1 DA2.1(IN) DD2.1(VCC) DD2.50(VCC) L1.1
VCCBAT: DD2.65(BVCC)
ADC_DI0_N: R36.6
ADC_DI0_P: R36.5
ADC_DI1_N: R37.6
ADC_DI1_P: R37.5
ADC_DI2_N: R38.6
ADC_DI2_P: R38.5
ADC_DV0_N: R36.8
ADC_DV0_P: R36.7
ADC_DV1_N: R37.8
ADC_DV1_P: R37.7
ADC_DV2_N: R38.8
ADC_DV2_P: R38.7
ADC_S1: R39.5
ADC_S2: R39.6
ADC_S3: R39.8
PA0: DD2.41(PA0)
PA1: DD2.40(PA1)
PA2: DD2.39(PA2)
PA3: DD2.38(PA3)
PA4: DD2.37(PA4)
PA5: DD2.36(PA5)
PA6: DD2.29(PA6/TCK)
PA7: DD2.34(PA7/TDO)
PA8: DD2.26(PA8/TMS)
PA9: DD2.32(PA9/TDI)
PA10: DD2.31(PA10)
PA11: DD2.30(PA11)
PA12: DD2.35(PA12)
PA13: DD2.28(PA13)
PA14: DD2.27(PA14)
PA15: DD2.33(PA15)
PB0: DD2.3(PB0)
PB1: DD2.4(PB1)
PB2: DD2.5(PB2)
PB3: DD2.6(PB3)
PB4: DD2.7(PB4)
PB5: DD2.8(PB5)
PB6: DD2.9(PB6)
PB7: DD2.10(PB7)
PB8: DD2.12(PB8)
PB9: DD2.11(PB9)
PB10: DD2.13(PB10)
PB11: DD2.14(PB11)
PB12: DD2.15(PB12)
PB13: DD2.16(PB13)
PB14: DD2.17(PB14)
PC0: DD2.51(PC0/MODE0)
PC1: DD2.52(PC1/MODE1)
PC2: DD2.53(PC2)
PC3: DD2.54(PC3)
PC4: DD2.55(PC4)
PC5: DD2.56(PC5)
PC6: DD2.57(PC6)
PC7: DD2.58(PC7)
PD0: DD2.18(PD0)
PD1: DD2.19(PD1)
PD2: DD2.20(PD2)
PD3: DD2.21(PD3)
PD4: DD2.22(PD4)
PD5: DD2.44(PD5)
PD6: DD2.43(PD6)
PD7: DD2.42(PD7)
PD8: DD2.25(PD8)
PD9: DD2.24(PD9)
PD10: DD2.23(PD10)
PD11: DD2.45(PD11)
PD12: DD2.46(PD12)
PD13: DD2.47(PD13)
PD14: DD2.48(PD14)
PD15: DD2.49(PD15)
RESET_N: DD2.59(~{RESET})
SAR_AIN1: C28.2 DD2.84(AIN1) R39.4
SAR_AIN2: C27.2 DD2.85(AIN2) R39.3
SAR_AIN3: C26.2 DD2.86(AIN3) R39.1
SD_IIN0_N: C21.2 DD2.70(I0_N) R36.3
SD_IIN0_P: C21.1 DD2.69(I0_P) R36.4
SD_IIN1_N: C23.2 DD2.76(I1_N) R37.3
SD_IIN1_P: C23.1 DD2.75(I1_P) R37.4
SD_IIN2_N: C25.2 DD2.80(I2_N) R38.3
SD_IIN2_P: C25.1 DD2.79(I2_P) R38.4
SD_IIN3_N: DD2.74(I3_N)
SD_IIN3_P: DD2.73(I3_P)
SD_VIN0_N: C20.2 DD2.72(V0_N) R36.1
SD_VIN0_P: C20.1 DD2.71(V0_P) R36.2
SD_VIN1_N: C22.2 DD2.78(V1_N) R37.1
SD_VIN1_P: C22.1 DD2.77(V1_P) R37.2
SD_VIN2_N: C24.2 DD2.82(V2_N) R38.1
SD_VIN2_P: C24.1 DD2.81(V2_P) R38.2
VCCBAT_SW: DD2.64(SW)
WAKEUP1: DD2.63(WAKEUP1)
WAKEUP2: DD2.62(WAKEUP2)
WAKEUP3: DD2.61(WAKEUP3)
NetC11_2: C11.2 DD2.67(OSC_IN32) ZQ1.1
NetC12_2: C12.2 DD2.66(OSC_OUT32) ZQ1.3
NetC13_2: C13.2 DD2.87(OSC_IN) ZQ2.1
NetC14_2: C14.2 DD2.88(OSC_OUT) ZQ2.3
NetC16_2: C16.2 DA2.2(OUT) R35.2
NetDD2_60: DD2.60(JTAG_EN) R34.1

Not connected (* = marked no-connect by the designer): R39 2 7

### Layout directives
differential pair: SD_IIN0_N, SD_IIN0_P, SD_IIN1_N, SD_IIN1_P, SD_IIN2_N, SD_IIN2_P, SD_IIN3_N, SD_IIN3_P, SD_VIN0_N, SD_VIN0_P, SD_VIN1_N, SD_VIN1_P, SD_VIN2_N, SD_VIN2_P

### Notes on the sheet
- А(1)
- Подп. и дата
- Инв. № дубл.
- Взам. инв. №
- Инв. № подл.
- Изм.
- Лист
- № докум.
- Подп.
- Дата
- Форма 2а ГОСТ 2.104-2006
- Копировал
- Формат А2
- (in symbol CAY10-101J4LF) *R
- (in symbol REF3325AIDBZR) *STU
- (in symbol К1986ВК025) MCU

### Library data of the parts
C11 C12 = GCM1555C1H8R2CA16D: Manufacturer: Murata; Type: Конденсатор; ID: 195; Value: 8.2pF; Voltage: 50V; Tolerance: ±0.25pF; Dielectric Type: NP0; Application Category: 1; Working Temperature Min: -55°С; Working Temperature Max: +125°С; Functional Analog: GRM1555C1H8R2CA01D, GCM1555C1H8R2CA16J, GCM1555C1H8R2CA16W; Published: 18.05.2010; Publisher: Andrew Danich; Part Number: GCM1555C1H8R2CA16D; Footprint: 0402
C13 C14 = GRM1555C1H160JA01D: Manufacturer: Murata; Type: Конденсатор; ID: 192; Value: 16pF; Voltage: 50V; Tolerance: ±5%; Dielectric Type: NP0; Application Category: 1; Working Temperature Min: -55°С; Working Temperature Max: +125°С; Functional Analog: GRM1555C1H160JA01J, GRM1555C1H160JA01W; Published: 18.05.2010; Publisher: Andrew Danich; Part Number: GRM1555C1H160JA01D; Footprint: 0402
C15-C17 C29 = GRM155C71A105KE11D: as C7 on sheet 01_USB_IO; Published: 18.05.2010; Publisher: Andrew Danich; Part Number: GRM155C71A105KE11D; Footprint: 0402
C18 = GRM155R60J106ME15D: as C5 on sheet 01_USB_IO; Published: 18.05.2010; Publisher: Andrew Danich; Part Number: GRM155R60J106ME15D; Footprint: 0402
C19 = GCM155R71C104KA55D: as C1 on sheet 01_USB_IO; Published: 18.05.2010; Publisher: Andrew Danich; Part Number: GCM155R71C104KA55D; Footprint: 0402
C20-C28 = GRM033R71A472KA01D: Manufacturer: Murata; Type: Конденсатор; Schematic Value: 4700pF, 10V, X7R; ID: 245; Value: 4700pF; Voltage: 10V; Tolerance: ±10%; Dielectric Type: X7R; Application Category: 1; Working Temperature Min: -55°С; Working Temperature Max: +125°С; Functional Analog: GRM033R71A472KA01EA01, GRM033R71A472KA01J, GRM033R71A472KA01W; Published: 18.05.2010; Publisher: Andrew Danich; Part Number: GRM033R71A472KA01D; Footprint: 0201
DA2 = REF3325AIDBZR: Manufacturer: Texas Instruments; ID: 25; Input Voltage: +2.68…5.5V; Output Current: 5mA; Output Voltage: +2.5V; Temperature Coefficient: 30ppm; Supply Current: 8.5uA; Noise: 70μV p-p; Application Category: 1; Working Temperature Min: -40°С; Working Temperature Max: +125°С; Functional Analog: REF3325AIDBZT; Published: 28.06.2020; Publisher: Andrew Danich; Type: Микросхема; Part Number: REF3325AIDBZR; Value: REF3325AIDBZR
DD2 = К1986ВК025: Manufacturer: Миландр; ID: 2; Supply Operation: +3.0…3.6V; Flash: 256+8Kb; SRAM: 112Kb; Prog Interface: JTAG; I/O Lines: 55; Operation Frequency: 60MHz; Application Category: 1; Working Temperature Min: -50°С; Working Temperature Max: +85°С; Published: 18.12.2020; Publisher: Andrew Danich; Type: Микросхема; Part Number: К1986ВК025; Value: К1986ВК025; EEPROM: -
L1 = BLM15HD102SN1D: Manufacturer: Murata; Type: Дроссель; Schematic Value: 1000ohm ±25%; ID: 7; Rated Current: 250mA; Impedance at 100Mhz: 1000ohm; Tolerance: ±25%; DC Resistance: 1.25ohm; Inductor Type: EMIFIL; Application Category: 1; Working Temperature Min: -55°С; Working Temperature Max: +125°С; Functional Analog: BLM15HD102SN1B; Published: 14.11.2014; Publisher: Andrew Danich; Part Number: BLM15HD102SN1D; Value: BLM15HD102SN1D; Footprint: 0402
R34 = RC0402JR-070RL: as R2 on sheet 01_USB_IO; Published: 24.03.2010; Publisher: Andrew Danich; Type: Резистор; Part Number: RC0402JR-070RL; Footprint: 0402
R35 = RC0402JR-070RL: Manufacturer: Yageo; ID: 362; Value: 0; Limit Voltage: 50V; Tolerance: ±5%; Temperature Coefficient: 100ppm; Total Power Dissipation: 0.1W; Series Type: Thick-Film; Application Category: 1; Working Temperature Min: -55°С; Working Temperature Max: +155°С; Published: 24.03.2010; Publisher: Andrew Danich; Type: Резистор; Part Number: RC0402JR-070RL; Footprint: 0402
R36-R39 = CAY10-101J4LF: Manufacturer: Bourns; Schematic Value: 100 ±5%; ID: 26; Value: 100; Limit Voltage: 50V; Tolerance: ±5%; Temperature Coefficient: 200ppm; Total Power Dissipation: 0,031W; Series Type: Thick-Film; Application Category: 1; Working Temperature Min: -55°С; Working Temperature Max: +125°С; Published: 15.07.2014; Publisher: Andrew Danich; Type: Набор резисторов; Part Number: CAY10-101J4LF
ZQ1 = SX-3215 32.768KHz: ID: 16; Shunt Capacitance: 1.2pF; Load Capacitance: 9pF; Application Category: 1; Published: 08.03.2013; Publisher: Andrew Danich; Type: Резонатор; Part Number: SX-3215 32.768KHz; Value: SX-3215 32.768KHz; Output Frequency: 32.768KHz
ZQ2 = 12.88602_KX-7-16.0MHz: Manufacturer: GEYER ELECTRONIC; ID: 23; Output Frequency: 16МГц; Load Capacitance: 10pF; Temperature Coefficient: ±30ppm; Application Category: 1; Working Temperature Min: -20°С; Working Temperature Max: +70°С; Published: 12.09.2014; Publisher: Andrew Danich; Type: Резонатор; Part Number: 12.88602_KX-7-16.0MHz; Value: 12.88602_KX-7-16.0MHz; Functional Analog: -

## Nets that join several sheets
AVREF: 01_USB_IO (XP1.9), 02_MCU_ANALOG (C17.2 DD2.83 R35.1)
GND: 01_USB_IO (46 pins), 02_MCU_ANALOG (17 pins)
VCC3P3: 01_USB_IO (20 pins), 02_MCU_ANALOG (7 pins)
VCCBAT: 01_USB_IO (C8.1 VD1.2 VT1.3), 02_MCU_ANALOG (DD2.65)
ADC_DI0_N: 01_USB_IO (XP1.21), 02_MCU_ANALOG (R36.6)
ADC_DI0_P: 01_USB_IO (XP1.22), 02_MCU_ANALOG (R36.5)
ADC_DI1_N: 01_USB_IO (XP1.17), 02_MCU_ANALOG (R37.6)
ADC_DI1_P: 01_USB_IO (XP1.18), 02_MCU_ANALOG (R37.5)
ADC_DI2_N: 01_USB_IO (XP1.14), 02_MCU_ANALOG (R38.6)
ADC_DI2_P: 01_USB_IO (XP1.13), 02_MCU_ANALOG (R38.5)
ADC_DV0_N: 01_USB_IO (XP1.19), 02_MCU_ANALOG (R36.8)
ADC_DV0_P: 01_USB_IO (XP1.20), 02_MCU_ANALOG (R36.7)
ADC_DV1_N: 01_USB_IO (XP1.15), 02_MCU_ANALOG (R37.8)
ADC_DV1_P: 01_USB_IO (XP1.16), 02_MCU_ANALOG (R37.7)
ADC_DV2_N: 01_USB_IO (XP1.12), 02_MCU_ANALOG (R38.8)
ADC_DV2_P: 01_USB_IO (XP1.11), 02_MCU_ANALOG (R38.7)
ADC_S1: 01_USB_IO (XP1.10), 02_MCU_ANALOG (R39.5)
ADC_S2: 01_USB_IO (XP1.8), 02_MCU_ANALOG (R39.6)
ADC_S3: 01_USB_IO (XP1.7), 02_MCU_ANALOG (R39.8)
PA0: 01_USB_IO (XP2.28), 02_MCU_ANALOG (DD2.41)
PA1: 01_USB_IO (XP2.25), 02_MCU_ANALOG (DD2.40)
PA2: 01_USB_IO (XP2.26), 02_MCU_ANALOG (DD2.39)
PA3: 01_USB_IO (XP2.23), 02_MCU_ANALOG (DD2.38)
PA4: 01_USB_IO (XP2.24), 02_MCU_ANALOG (DD2.37)
PA5: 01_USB_IO (XP2.21), 02_MCU_ANALOG (DD2.36)
PA6: 01_USB_IO (R10.1 XS2.4), 02_MCU_ANALOG (DD2.29)
PA7: 01_USB_IO (XS2.6), 02_MCU_ANALOG (DD2.34)
PA8: 01_USB_IO (R11.1 XS2.2), 02_MCU_ANALOG (DD2.26)
PA9: 01_USB_IO (R8.1 XS2.8), 02_MCU_ANALOG (DD2.32)
PB0: 01_USB_IO (R26.1), 02_MCU_ANALOG (DD2.3)
PB1: 01_USB_IO (R25.1), 02_MCU_ANALOG (DD2.4)
PB3: 01_USB_IO (R31.2), 02_MCU_ANALOG (DD2.6)
PB4: 01_USB_IO (R32.2), 02_MCU_ANALOG (DD2.7)
PB5: 01_USB_IO (R33.2), 02_MCU_ANALOG (DD2.8)
PB6: 01_USB_IO (XP2.8), 02_MCU_ANALOG (DD2.9)
PB7: 01_USB_IO (XP2.7), 02_MCU_ANALOG (DD2.10)
PB8: 01_USB_IO (XP2.9), 02_MCU_ANALOG (DD2.12)
PB9: 01_USB_IO (XP2.10), 02_MCU_ANALOG (DD2.11)
PB10: 01_USB_IO (XP2.12), 02_MCU_ANALOG (DD2.13)
PB11: 01_USB_IO (XP2.11), 02_MCU_ANALOG (DD2.14)
PB12: 01_USB_IO (XP2.14), 02_MCU_ANALOG (DD2.15)
PB13: 01_USB_IO (XP2.13), 02_MCU_ANALOG (DD2.16)
PC0: 01_USB_IO (R2.1 R9.2), 02_MCU_ANALOG (DD2.51)
PC1: 01_USB_IO (R3.1 R6.2), 02_MCU_ANALOG (DD2.52)
PC2: 01_USB_IO (R16.2 XP1.30), 02_MCU_ANALOG (DD2.53)
PC3: 01_USB_IO (R17.2 XP1.29), 02_MCU_ANALOG (DD2.54)
PC4: 01_USB_IO (XP1.28), 02_MCU_ANALOG (DD2.55)
PC5: 01_USB_IO (XP1.27), 02_MCU_ANALOG (DD2.56)
PD0: 01_USB_IO (XP2.16), 02_MCU_ANALOG (DD2.18)
PD1: 01_USB_IO (XP2.15), 02_MCU_ANALOG (DD2.19)
PD2: 01_USB_IO (XP2.18), 02_MCU_ANALOG (DD2.20)
PD3: 01_USB_IO (XP2.17), 02_MCU_ANALOG (DD2.21)
PD4: 01_USB_IO (XP2.20), 02_MCU_ANALOG (DD2.22)
PD5: 01_USB_IO (XP2.29), 02_MCU_ANALOG (DD2.44)
PD6: 01_USB_IO (XP2.30), 02_MCU_ANALOG (DD2.43)
PD7: 01_USB_IO (XP2.27), 02_MCU_ANALOG (DD2.42)
PD8: 01_USB_IO (XP2.22), 02_MCU_ANALOG (DD2.25)
PD9: 01_USB_IO (XP2.19), 02_MCU_ANALOG (DD2.24)
RESET_N: 01_USB_IO (5 pins), 02_MCU_ANALOG (DD2.59)
VCCBAT_SW: 01_USB_IO (R24.1), 02_MCU_ANALOG (DD2.64)
WAKEUP1: 01_USB_IO (R13.2), 02_MCU_ANALOG (DD2.63)
WAKEUP2: 01_USB_IO (R14.2), 02_MCU_ANALOG (DD2.62)
WAKEUP3: 01_USB_IO (R15.2), 02_MCU_ANALOG (DD2.61)